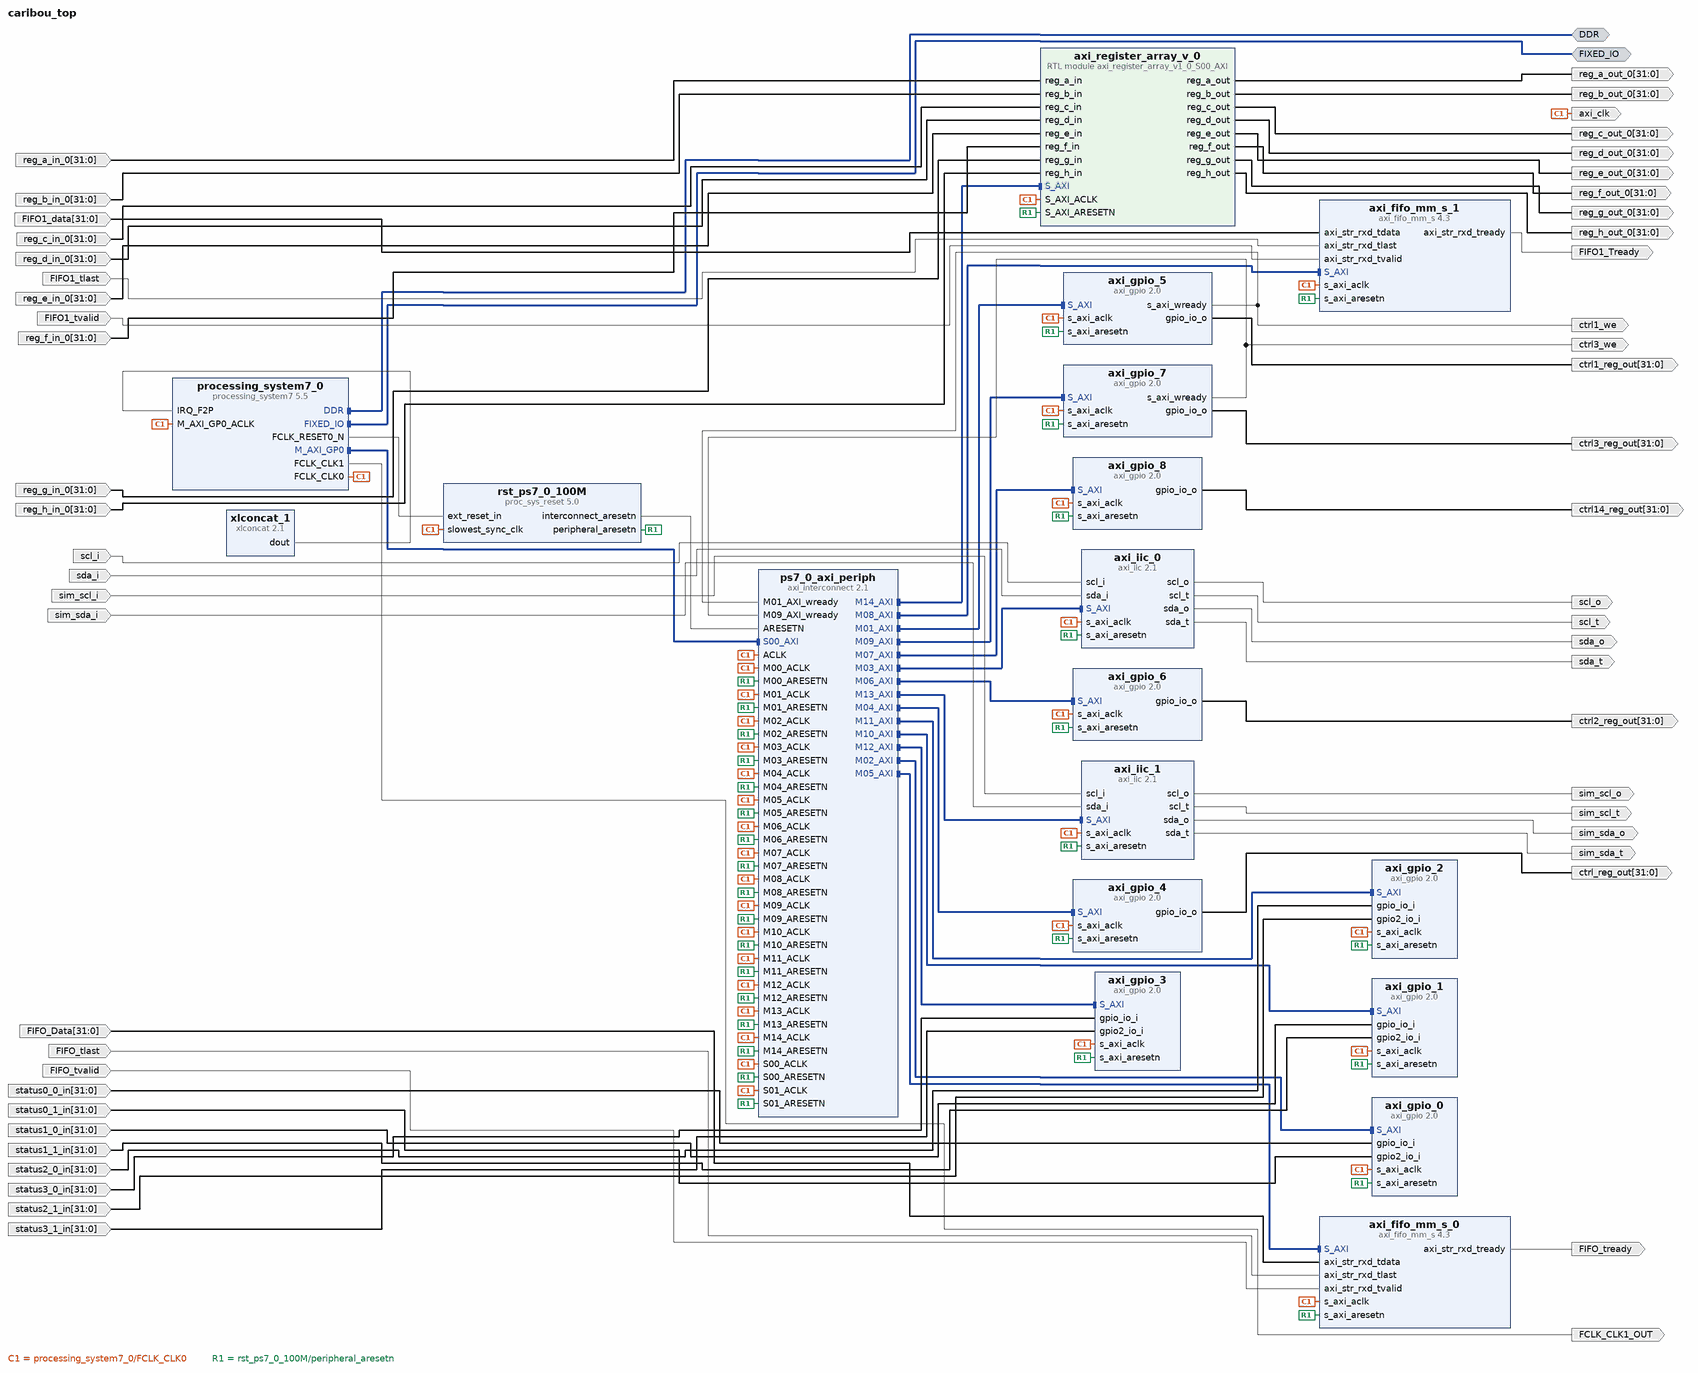
[diagram p0: block diagram of the top level]
# Vivado block design caribou_top, xc7z045ffg900-2, Vivado 2023.2
create_bd_design caribou_top

create_bd_intf_port -mode Master -vlnv xilinx.com:interface:ddrx_rtl:1.0 DDR
create_bd_intf_port -mode Master -vlnv xilinx.com:display_processing_system7:fixedio_rtl:1.0 FIXED_IO
create_bd_port -dir O axi_clk
create_bd_port -dir O -type clk scl_o
create_bd_port -dir I -type clk scl_i
create_bd_port -dir O sda_o
create_bd_port -dir O scl_t
create_bd_port -dir O sda_t
create_bd_port -dir I sda_i
create_bd_port -dir O -from 31 -to 0 -type data ctrl_reg_out
create_bd_port -dir I -from 31 -to 0 FIFO_Data
create_bd_port -dir I FIFO_tlast
create_bd_port -dir O FIFO_tready
create_bd_port -dir I FIFO_tvalid
create_bd_port -dir O -from 31 -to 0 -type data ctrl1_reg_out
create_bd_port -dir O -from 31 -to 0 -type data ctrl2_reg_out
create_bd_port -dir I -type data FIFO1_tlast
create_bd_port -dir I -from 31 -to 0 -type data FIFO1_data
create_bd_port -dir I -type data FIFO1_tvalid
create_bd_port -dir O -type data FIFO1_Tready
create_bd_port -dir I -from 31 -to 0 status0_0_in
create_bd_port -dir I -from 31 -to 0 status0_1_in
create_bd_port -dir O ctrl1_we
create_bd_port -dir O -from 31 -to 0 -type data ctrl3_reg_out
create_bd_port -dir O ctrl3_we
create_bd_port -dir O -from 31 -to 0 -type data ctrl14_reg_out
create_bd_port -dir I -from 31 -to 0 status1_0_in
create_bd_port -dir I -from 31 -to 0 status1_1_in
create_bd_port -dir O -type clk FCLK_CLK1_OUT
create_bd_port -dir I -from 31 -to 0 -type data status2_0_in
create_bd_port -dir I -from 31 -to 0 -type data status2_1_in
create_bd_port -dir I -from 31 -to 0 -type data status3_0_in
create_bd_port -dir I -from 31 -to 0 -type data status3_1_in
create_bd_port -dir O sim_scl_o
create_bd_port -dir O sim_scl_t
create_bd_port -dir O sim_sda_o
create_bd_port -dir O sim_sda_t
create_bd_port -dir I sim_scl_i
create_bd_port -dir I sim_sda_i
create_bd_port -dir I -from 31 -to 0 reg_a_in_0
create_bd_port -dir O -from 31 -to 0 reg_a_out_0
create_bd_port -dir I -from 31 -to 0 reg_b_in_0
create_bd_port -dir O -from 31 -to 0 reg_b_out_0
create_bd_port -dir I -from 31 -to 0 reg_c_in_0
create_bd_port -dir O -from 31 -to 0 reg_c_out_0
create_bd_port -dir I -from 31 -to 0 reg_d_in_0
create_bd_port -dir O -from 31 -to 0 reg_d_out_0
create_bd_port -dir I -from 31 -to 0 reg_e_in_0
create_bd_port -dir O -from 31 -to 0 reg_e_out_0
create_bd_port -dir I -from 31 -to 0 reg_f_in_0
create_bd_port -dir O -from 31 -to 0 reg_f_out_0
create_bd_port -dir I -from 31 -to 0 reg_g_in_0
create_bd_port -dir O -from 31 -to 0 reg_g_out_0
create_bd_port -dir I -from 31 -to 0 reg_h_in_0
create_bd_port -dir O -from 31 -to 0 reg_h_out_0

create_bd_cell -type ip -vlnv xilinx.com:ip:xlconcat:2.1 xlconcat_1
set_property -dict {CONFIG.NUM_PORTS 3 CONFIG.dout_width 3} [get_bd_cells xlconcat_1]
create_bd_cell -type ip -vlnv xilinx.com:ip:processing_system7:5.5 processing_system7_0
set_property -dict [list \
  CONFIG.PCW_APU_PERIPHERAL_FREQMHZ 800 \
  CONFIG.PCW_CPU_CPU_6X4X_MAX_RANGE 800 \
  CONFIG.PCW_DUAL_PARALLEL_QSPI_DATA_MODE x8 \
  CONFIG.PCW_ENET0_ENET0_IO {MIO 16 .. 27} \
  CONFIG.PCW_ENET0_GRP_MDIO_ENABLE 1 \
  CONFIG.PCW_ENET0_GRP_MDIO_IO {MIO 52 .. 53} \
  CONFIG.PCW_ENET0_PERIPHERAL_ENABLE 1 \
  CONFIG.PCW_ENET0_PERIPHERAL_FREQMHZ {100 Mbps} \
  CONFIG.PCW_ENET0_RESET_ENABLE 1 \
  CONFIG.PCW_ENET0_RESET_IO {MIO 47} \
  CONFIG.PCW_ENET_RESET_ENABLE 1 \
  CONFIG.PCW_ENET_RESET_SELECT {Share reset pin} \
  CONFIG.PCW_EN_CLK1_PORT 1 \
  CONFIG.PCW_FCLK_CLK1_BUF TRUE \
  CONFIG.PCW_FPGA0_PERIPHERAL_FREQMHZ 50 \
  CONFIG.PCW_FPGA1_PERIPHERAL_FREQMHZ 40 \
  CONFIG.PCW_FPGA_FCLK1_ENABLE 1 \
  CONFIG.PCW_GP0_EN_MODIFIABLE_TXN 0 \
  CONFIG.PCW_GP1_EN_MODIFIABLE_TXN 0 \
  CONFIG.PCW_GPIO_MIO_GPIO_ENABLE 1 \
  CONFIG.PCW_GPIO_MIO_GPIO_IO MIO \
  CONFIG.PCW_I2C0_GRP_INT_ENABLE 0 \
  CONFIG.PCW_I2C0_I2C0_IO {MIO 50 .. 51} \
  CONFIG.PCW_I2C0_PERIPHERAL_ENABLE 1 \
  CONFIG.PCW_I2C0_RESET_ENABLE 1 \
  CONFIG.PCW_I2C0_RESET_IO {MIO 46} \
  CONFIG.PCW_I2C_PERIPHERAL_FREQMHZ 133.333328 \
  CONFIG.PCW_I2C_RESET_ENABLE 1 \
  CONFIG.PCW_I2C_RESET_SELECT {Share reset pin} \
  CONFIG.PCW_IRQ_F2P_INTR 1 \
  CONFIG.PCW_M_AXI_GP0_FREQMHZ 200 \
  CONFIG.PCW_NUM_F2P_INTR_INPUTS 3 \
  CONFIG.PCW_PERIPHERAL_BOARD_PRESET part0 \
  CONFIG.PCW_PRESET_BANK0_VOLTAGE {LVCMOS 1.8V} \
  CONFIG.PCW_PRESET_BANK1_VOLTAGE {LVCMOS 1.8V} \
  CONFIG.PCW_QSPI_GRP_FBCLK_ENABLE 1 \
  CONFIG.PCW_QSPI_GRP_FBCLK_IO {MIO 8} \
  CONFIG.PCW_QSPI_GRP_IO1_ENABLE 1 \
  CONFIG.PCW_QSPI_GRP_IO1_IO {MIO 0 9 .. 13} \
  CONFIG.PCW_QSPI_GRP_SINGLE_SS_ENABLE 0 \
  CONFIG.PCW_QSPI_INTERNAL_HIGHADDRESS 0xFDFFFFFF \
  CONFIG.PCW_QSPI_PERIPHERAL_ENABLE 1 \
  CONFIG.PCW_QSPI_QSPI_IO {MIO 1 .. 6} \
  CONFIG.PCW_SD0_GRP_CD_ENABLE 1 \
  CONFIG.PCW_SD0_GRP_CD_IO {MIO 14} \
  CONFIG.PCW_SD0_GRP_WP_ENABLE 1 \
  CONFIG.PCW_SD0_GRP_WP_IO {MIO 15} \
  CONFIG.PCW_SD0_PERIPHERAL_ENABLE 1 \
  CONFIG.PCW_SD0_SD0_IO {MIO 40 .. 45} \
  CONFIG.PCW_SDIO_PERIPHERAL_FREQMHZ 50 \
  CONFIG.PCW_TTC0_PERIPHERAL_ENABLE 1 \
  CONFIG.PCW_TTC0_TTC0_IO EMIO \
  CONFIG.PCW_UART1_PERIPHERAL_ENABLE 1 \
  CONFIG.PCW_UART1_UART1_IO {MIO 48 .. 49} \
  CONFIG.PCW_UART_PERIPHERAL_FREQMHZ 50 \
  CONFIG.PCW_UIPARAM_DDR_FREQ_MHZ 533.333313 \
  CONFIG.PCW_UIPARAM_DDR_PARTNO Custom \
  CONFIG.PCW_UIPARAM_GENERATE_SUMMARY NONE \
  CONFIG.PCW_USB0_PERIPHERAL_ENABLE 1 \
  CONFIG.PCW_USB0_RESET_ENABLE 1 \
  CONFIG.PCW_USB0_RESET_IO {MIO 7} \
  CONFIG.PCW_USB0_USB0_IO {MIO 28 .. 39} \
  CONFIG.PCW_USB_RESET_ENABLE 1 \
  CONFIG.PCW_USB_RESET_SELECT {Share reset pin} \
  CONFIG.PCW_USE_FABRIC_INTERRUPT 1 \
  CONFIG.preset ZC706 \
] [get_bd_cells processing_system7_0]
# 517 more settings of processing_system7_0 are not shown: defaults, MIO pin electricals, DDR timing, and values the tool derives
create_bd_cell -type ip -vlnv xilinx.com:ip:axi_fifo_mm_s:4.3 axi_fifo_mm_s_0
set_property -dict [list \
  CONFIG.C_RX_FIFO_DEPTH 32768 \
  CONFIG.C_RX_FIFO_PE_THRESHOLD 5 \
  CONFIG.C_RX_FIFO_PF_THRESHOLD 32000 \
  CONFIG.C_USE_RX_DATA 1 \
  CONFIG.C_USE_TX_CTRL 0 \
  CONFIG.C_USE_TX_DATA 0 \
] [get_bd_cells axi_fifo_mm_s_0]
create_bd_cell -type ip -vlnv xilinx.com:ip:axi_fifo_mm_s:4.3 axi_fifo_mm_s_1
set_property -dict [list \
  CONFIG.C_HAS_AXIS_TSTRB false \
  CONFIG.C_RX_FIFO_DEPTH 32768 \
  CONFIG.C_RX_FIFO_PE_THRESHOLD 5 \
  CONFIG.C_RX_FIFO_PF_THRESHOLD 32000 \
  CONFIG.C_USE_TX_CTRL 0 \
  CONFIG.C_USE_TX_DATA 0 \
] [get_bd_cells axi_fifo_mm_s_1]
create_bd_cell -type ip -vlnv xilinx.com:ip:axi_iic:2.1 axi_iic_0
set_property -dict {CONFIG.IIC_FREQ_KHZ 400} [get_bd_cells axi_iic_0]
create_bd_cell -type ip -vlnv xilinx.com:ip:axi_interconnect:2.1 ps7_0_axi_periph
set_property -dict {CONFIG.NUM_MI 15 CONFIG.NUM_SI 2 CONFIG.SYNCHRONIZATION_STAGES 2} [get_bd_cells ps7_0_axi_periph]
create_bd_cell -type ip -vlnv xilinx.com:ip:proc_sys_reset:5.0 rst_ps7_0_100M
create_bd_cell -type ip -vlnv xilinx.com:ip:axi_gpio:2.0 axi_gpio_0
set_property -dict [list \
  CONFIG.C_ALL_INPUTS 1 \
  CONFIG.C_ALL_INPUTS_2 1 \
  CONFIG.C_GPIO_WIDTH 32 \
  CONFIG.C_IS_DUAL 1 \
  CONFIG.GPIO2_BOARD_INTERFACE Custom \
  CONFIG.GPIO_BOARD_INTERFACE Custom \
  CONFIG.USE_BOARD_FLOW true \
] [get_bd_cells axi_gpio_0]
create_bd_cell -type ip -vlnv xilinx.com:ip:axi_gpio:2.0 axi_gpio_1
set_property -dict [list \
  CONFIG.C_ALL_INPUTS 1 \
  CONFIG.C_ALL_INPUTS_2 1 \
  CONFIG.C_GPIO_WIDTH 32 \
  CONFIG.C_IS_DUAL 1 \
  CONFIG.GPIO2_BOARD_INTERFACE Custom \
  CONFIG.GPIO_BOARD_INTERFACE Custom \
  CONFIG.USE_BOARD_FLOW true \
] [get_bd_cells axi_gpio_1]
create_bd_cell -type ip -vlnv xilinx.com:ip:axi_gpio:2.0 axi_gpio_2
set_property -dict [list \
  CONFIG.C_ALL_INPUTS 1 \
  CONFIG.C_ALL_INPUTS_2 1 \
  CONFIG.C_GPIO_WIDTH 32 \
  CONFIG.C_IS_DUAL 1 \
  CONFIG.GPIO_BOARD_INTERFACE Custom \
  CONFIG.USE_BOARD_FLOW true \
] [get_bd_cells axi_gpio_2]
create_bd_cell -type ip -vlnv xilinx.com:ip:axi_gpio:2.0 axi_gpio_3
set_property -dict {CONFIG.C_ALL_INPUTS 1 CONFIG.C_ALL_INPUTS_2 1 CONFIG.C_IS_DUAL 1} [get_bd_cells axi_gpio_3]
create_bd_cell -type ip -vlnv xilinx.com:ip:axi_iic:2.1 axi_iic_1
set_property -dict {CONFIG.IIC_FREQ_KHZ 400} [get_bd_cells axi_iic_1]
create_bd_cell -type module -reference axi_register_array_v1_0_S00_AXI axi_register_array_v_0
create_bd_cell -type ip -vlnv xilinx.com:ip:axi_gpio:2.0 axi_gpio_4
set_property -dict {CONFIG.C_ALL_OUTPUTS 1} [get_bd_cells axi_gpio_4]
create_bd_cell -type ip -vlnv xilinx.com:ip:axi_gpio:2.0 axi_gpio_5
set_property -dict {CONFIG.C_ALL_OUTPUTS 1} [get_bd_cells axi_gpio_5]
create_bd_cell -type ip -vlnv xilinx.com:ip:axi_gpio:2.0 axi_gpio_6
set_property -dict {CONFIG.C_ALL_OUTPUTS 1} [get_bd_cells axi_gpio_6]
create_bd_cell -type ip -vlnv xilinx.com:ip:axi_gpio:2.0 axi_gpio_7
set_property -dict {CONFIG.C_ALL_OUTPUTS 1} [get_bd_cells axi_gpio_7]
create_bd_cell -type ip -vlnv xilinx.com:ip:axi_gpio:2.0 axi_gpio_8
set_property -dict {CONFIG.C_ALL_OUTPUTS 1} [get_bd_cells axi_gpio_8]

# ---- connections ----

connect_bd_intf_net [get_bd_intf_ports DDR] [get_bd_intf_pins processing_system7_0/DDR]
connect_bd_intf_net [get_bd_intf_ports FIXED_IO] [get_bd_intf_pins processing_system7_0/FIXED_IO]
connect_bd_intf_net [get_bd_intf_pins processing_system7_0/M_AXI_GP0] [get_bd_intf_pins ps7_0_axi_periph/S00_AXI]
connect_bd_intf_net [get_bd_intf_pins ps7_0_axi_periph/M01_AXI] [get_bd_intf_pins axi_gpio_5/S_AXI]
connect_bd_intf_net [get_bd_intf_pins ps7_0_axi_periph/M02_AXI] [get_bd_intf_pins axi_gpio_0/S_AXI]
connect_bd_intf_net [get_bd_intf_pins ps7_0_axi_periph/M03_AXI] [get_bd_intf_pins axi_iic_0/S_AXI]
connect_bd_intf_net [get_bd_intf_pins ps7_0_axi_periph/M04_AXI] [get_bd_intf_pins axi_gpio_4/S_AXI]
connect_bd_intf_net [get_bd_intf_pins ps7_0_axi_periph/M05_AXI] [get_bd_intf_pins axi_fifo_mm_s_0/S_AXI]
connect_bd_intf_net [get_bd_intf_pins ps7_0_axi_periph/M06_AXI] [get_bd_intf_pins axi_gpio_6/S_AXI]
connect_bd_intf_net [get_bd_intf_pins ps7_0_axi_periph/M07_AXI] [get_bd_intf_pins axi_gpio_8/S_AXI]
connect_bd_intf_net [get_bd_intf_pins ps7_0_axi_periph/M08_AXI] [get_bd_intf_pins axi_fifo_mm_s_1/S_AXI]
connect_bd_intf_net [get_bd_intf_pins ps7_0_axi_periph/M09_AXI] [get_bd_intf_pins axi_gpio_7/S_AXI]
connect_bd_intf_net [get_bd_intf_pins ps7_0_axi_periph/M10_AXI] [get_bd_intf_pins axi_gpio_1/S_AXI]
connect_bd_intf_net [get_bd_intf_pins ps7_0_axi_periph/M11_AXI] [get_bd_intf_pins axi_gpio_2/S_AXI]
connect_bd_intf_net [get_bd_intf_pins ps7_0_axi_periph/M12_AXI] [get_bd_intf_pins axi_gpio_3/S_AXI]
connect_bd_intf_net [get_bd_intf_pins ps7_0_axi_periph/M13_AXI] [get_bd_intf_pins axi_iic_1/S_AXI]
connect_bd_intf_net [get_bd_intf_pins ps7_0_axi_periph/M14_AXI] [get_bd_intf_pins axi_register_array_v_0/S_AXI]
connect_bd_net [get_bd_ports FIFO1_data] [get_bd_pins axi_fifo_mm_s_1/axi_str_rxd_tdata]
connect_bd_net [get_bd_ports FIFO1_tlast] [get_bd_pins axi_fifo_mm_s_1/axi_str_rxd_tlast]
connect_bd_net [get_bd_ports FIFO1_tvalid] [get_bd_pins axi_fifo_mm_s_1/axi_str_rxd_tvalid]
connect_bd_net [get_bd_ports FIFO_Data] [get_bd_pins axi_fifo_mm_s_0/axi_str_rxd_tdata]
connect_bd_net [get_bd_ports FIFO_tlast] [get_bd_pins axi_fifo_mm_s_0/axi_str_rxd_tlast]
connect_bd_net [get_bd_ports FIFO_tvalid] [get_bd_pins axi_fifo_mm_s_0/axi_str_rxd_tvalid]
connect_bd_net [get_bd_pins axi_fifo_mm_s_0/axi_str_rxd_tready] [get_bd_ports FIFO_tready]
connect_bd_net [get_bd_pins axi_fifo_mm_s_1/axi_str_rxd_tready] [get_bd_ports FIFO1_Tready]
connect_bd_net [get_bd_pins axi_gpio_4/gpio_io_o] [get_bd_ports ctrl_reg_out]
connect_bd_net [get_bd_pins axi_gpio_5/gpio_io_o] [get_bd_ports ctrl1_reg_out]
connect_bd_net [get_bd_pins axi_gpio_6/gpio_io_o] [get_bd_ports ctrl2_reg_out]
connect_bd_net [get_bd_pins axi_gpio_7/gpio_io_o] [get_bd_ports ctrl3_reg_out]
connect_bd_net [get_bd_pins axi_gpio_8/gpio_io_o] [get_bd_ports ctrl14_reg_out]
connect_bd_net [get_bd_pins axi_iic_0/scl_o] [get_bd_ports scl_o]
connect_bd_net [get_bd_pins axi_iic_0/scl_t] [get_bd_ports scl_t]
connect_bd_net [get_bd_pins axi_iic_0/sda_o] [get_bd_ports sda_o]
connect_bd_net [get_bd_pins axi_iic_0/sda_t] [get_bd_ports sda_t]
connect_bd_net [get_bd_pins axi_iic_1/scl_o] [get_bd_ports sim_scl_o]
connect_bd_net [get_bd_pins axi_iic_1/scl_t] [get_bd_ports sim_scl_t]
connect_bd_net [get_bd_pins axi_iic_1/sda_o] [get_bd_ports sim_sda_o]
connect_bd_net [get_bd_pins axi_iic_1/sda_t] [get_bd_ports sim_sda_t]
connect_bd_net [get_bd_pins axi_register_array_v_0/reg_a_out] [get_bd_ports reg_a_out_0]
connect_bd_net [get_bd_pins axi_register_array_v_0/reg_b_out] [get_bd_ports reg_b_out_0]
connect_bd_net [get_bd_pins axi_register_array_v_0/reg_c_out] [get_bd_ports reg_c_out_0]
connect_bd_net [get_bd_pins axi_register_array_v_0/reg_d_out] [get_bd_ports reg_d_out_0]
connect_bd_net [get_bd_pins axi_register_array_v_0/reg_e_out] [get_bd_ports reg_e_out_0]
connect_bd_net [get_bd_pins axi_register_array_v_0/reg_f_out] [get_bd_ports reg_f_out_0]
connect_bd_net [get_bd_pins axi_register_array_v_0/reg_g_out] [get_bd_ports reg_g_out_0]
connect_bd_net [get_bd_pins axi_register_array_v_0/reg_h_out] [get_bd_ports reg_h_out_0]
connect_bd_net -net control_register_1_s00_axi_wready [get_bd_pins axi_gpio_5/s_axi_wready] \
  [get_bd_ports ctrl1_we] [get_bd_pins ps7_0_axi_periph/M01_AXI_wready]
connect_bd_net -net control_register_3_s00_axi_wready [get_bd_pins axi_gpio_7/s_axi_wready] \
  [get_bd_ports ctrl3_we] [get_bd_pins ps7_0_axi_periph/M09_AXI_wready]
connect_bd_net [get_bd_pins processing_system7_0/FCLK_CLK0] \
  [get_bd_ports axi_clk] [get_bd_pins axi_register_array_v_0/S_AXI_ACLK] [get_bd_pins axi_fifo_mm_s_0/s_axi_aclk] \
  [get_bd_pins axi_fifo_mm_s_1/s_axi_aclk] [get_bd_pins axi_gpio_0/s_axi_aclk] [get_bd_pins axi_gpio_1/s_axi_aclk] \
  [get_bd_pins axi_gpio_2/s_axi_aclk] [get_bd_pins axi_gpio_3/s_axi_aclk] [get_bd_pins axi_iic_0/s_axi_aclk] \
  [get_bd_pins axi_iic_1/s_axi_aclk] [get_bd_pins processing_system7_0/M_AXI_GP0_ACLK] [get_bd_pins ps7_0_axi_periph/ACLK] \
  [get_bd_pins ps7_0_axi_periph/S00_ACLK] [get_bd_pins ps7_0_axi_periph/S01_ACLK] [get_bd_pins ps7_0_axi_periph/M00_ACLK] \
  [get_bd_pins ps7_0_axi_periph/M01_ACLK] [get_bd_pins ps7_0_axi_periph/M02_ACLK] [get_bd_pins ps7_0_axi_periph/M03_ACLK] \
  [get_bd_pins ps7_0_axi_periph/M04_ACLK] [get_bd_pins ps7_0_axi_periph/M05_ACLK] [get_bd_pins ps7_0_axi_periph/M06_ACLK] \
  [get_bd_pins ps7_0_axi_periph/M07_ACLK] [get_bd_pins ps7_0_axi_periph/M08_ACLK] [get_bd_pins ps7_0_axi_periph/M09_ACLK] \
  [get_bd_pins ps7_0_axi_periph/M10_ACLK] [get_bd_pins ps7_0_axi_periph/M11_ACLK] [get_bd_pins ps7_0_axi_periph/M12_ACLK] \
  [get_bd_pins ps7_0_axi_periph/M13_ACLK] [get_bd_pins ps7_0_axi_periph/M14_ACLK] \
  [get_bd_pins rst_ps7_0_100M/slowest_sync_clk] [get_bd_pins axi_gpio_4/s_axi_aclk] [get_bd_pins axi_gpio_5/s_axi_aclk] \
  [get_bd_pins axi_gpio_6/s_axi_aclk] [get_bd_pins axi_gpio_7/s_axi_aclk] [get_bd_pins axi_gpio_8/s_axi_aclk]
connect_bd_net [get_bd_pins processing_system7_0/FCLK_CLK1] [get_bd_ports FCLK_CLK1_OUT]
connect_bd_net [get_bd_pins processing_system7_0/FCLK_RESET0_N] [get_bd_pins rst_ps7_0_100M/ext_reset_in]
connect_bd_net -net reg_a_in_0_1 [get_bd_ports reg_a_in_0] [get_bd_pins axi_register_array_v_0/reg_a_in]
connect_bd_net -net reg_b_in_0_1 [get_bd_ports reg_b_in_0] [get_bd_pins axi_register_array_v_0/reg_b_in]
connect_bd_net -net reg_c_in_0_1 [get_bd_ports reg_c_in_0] [get_bd_pins axi_register_array_v_0/reg_c_in]
connect_bd_net -net reg_d_in_0_1 [get_bd_ports reg_d_in_0] [get_bd_pins axi_register_array_v_0/reg_d_in]
connect_bd_net -net reg_e_in_0_1 [get_bd_ports reg_e_in_0] [get_bd_pins axi_register_array_v_0/reg_e_in]
connect_bd_net -net reg_f_in_0_1 [get_bd_ports reg_f_in_0] [get_bd_pins axi_register_array_v_0/reg_f_in]
connect_bd_net -net reg_g_in_0_1 [get_bd_ports reg_g_in_0] [get_bd_pins axi_register_array_v_0/reg_g_in]
connect_bd_net -net reg_h_in_0_1 [get_bd_ports reg_h_in_0] [get_bd_pins axi_register_array_v_0/reg_h_in]
connect_bd_net [get_bd_pins rst_ps7_0_100M/interconnect_aresetn] [get_bd_pins ps7_0_axi_periph/ARESETN]
connect_bd_net [get_bd_pins rst_ps7_0_100M/peripheral_aresetn] \
  [get_bd_pins axi_register_array_v_0/S_AXI_ARESETN] [get_bd_pins axi_fifo_mm_s_0/s_axi_aresetn] \
  [get_bd_pins axi_fifo_mm_s_1/s_axi_aresetn] [get_bd_pins axi_gpio_0/s_axi_aresetn] [get_bd_pins axi_gpio_1/s_axi_aresetn] \
  [get_bd_pins axi_gpio_2/s_axi_aresetn] [get_bd_pins axi_gpio_3/s_axi_aresetn] [get_bd_pins axi_iic_0/s_axi_aresetn] \
  [get_bd_pins axi_iic_1/s_axi_aresetn] [get_bd_pins ps7_0_axi_periph/S00_ARESETN] [get_bd_pins ps7_0_axi_periph/S01_ARESETN] \
  [get_bd_pins ps7_0_axi_periph/M00_ARESETN] [get_bd_pins ps7_0_axi_periph/M01_ARESETN] \
  [get_bd_pins ps7_0_axi_periph/M02_ARESETN] [get_bd_pins ps7_0_axi_periph/M03_ARESETN] \
  [get_bd_pins ps7_0_axi_periph/M04_ARESETN] [get_bd_pins ps7_0_axi_periph/M05_ARESETN] \
  [get_bd_pins ps7_0_axi_periph/M06_ARESETN] [get_bd_pins ps7_0_axi_periph/M07_ARESETN] \
  [get_bd_pins ps7_0_axi_periph/M08_ARESETN] [get_bd_pins ps7_0_axi_periph/M09_ARESETN] \
  [get_bd_pins ps7_0_axi_periph/M10_ARESETN] [get_bd_pins ps7_0_axi_periph/M11_ARESETN] \
  [get_bd_pins ps7_0_axi_periph/M12_ARESETN] [get_bd_pins ps7_0_axi_periph/M13_ARESETN] \
  [get_bd_pins ps7_0_axi_periph/M14_ARESETN] [get_bd_pins axi_gpio_4/s_axi_aresetn] [get_bd_pins axi_gpio_5/s_axi_aresetn] \
  [get_bd_pins axi_gpio_6/s_axi_aresetn] [get_bd_pins axi_gpio_7/s_axi_aresetn] [get_bd_pins axi_gpio_8/s_axi_aresetn]
connect_bd_net [get_bd_ports scl_i] [get_bd_pins axi_iic_0/scl_i]
connect_bd_net [get_bd_ports sda_i] [get_bd_pins axi_iic_0/sda_i]
connect_bd_net [get_bd_ports sim_scl_i] [get_bd_pins axi_iic_1/scl_i]
connect_bd_net [get_bd_ports sim_sda_i] [get_bd_pins axi_iic_1/sda_i]
connect_bd_net [get_bd_ports status0_0_in] [get_bd_pins axi_gpio_0/gpio_io_i]
connect_bd_net [get_bd_ports status0_1_in] [get_bd_pins axi_gpio_0/gpio2_io_i]
connect_bd_net [get_bd_ports status1_0_in] [get_bd_pins axi_gpio_1/gpio_io_i]
connect_bd_net [get_bd_ports status1_1_in] [get_bd_pins axi_gpio_1/gpio2_io_i]
connect_bd_net [get_bd_ports status2_0_in] [get_bd_pins axi_gpio_2/gpio_io_i]
connect_bd_net [get_bd_ports status2_1_in] [get_bd_pins axi_gpio_2/gpio2_io_i]
connect_bd_net [get_bd_ports status3_0_in] [get_bd_pins axi_gpio_3/gpio_io_i]
connect_bd_net [get_bd_ports status3_1_in] [get_bd_pins axi_gpio_3/gpio2_io_i]
connect_bd_net [get_bd_pins xlconcat_1/dout] [get_bd_pins processing_system7_0/IRQ_F2P]

# ---- address map ----
assign_bd_address -offset 0x41200000 -range 4K -target_address_space [get_bd_addr_spaces processing_system7_0/Data] [get_bd_addr_segs axi_gpio_1/S_AXI/Reg]
assign_bd_address -offset 0x41210000 -range 64K -target_address_space [get_bd_addr_spaces processing_system7_0/Data] [get_bd_addr_segs axi_gpio_2/S_AXI/Reg]
assign_bd_address -offset 0x41220000 -range 64K -target_address_space [get_bd_addr_spaces processing_system7_0/Data] [get_bd_addr_segs axi_gpio_3/S_AXI/Reg]
assign_bd_address -offset 0x41600000 -range 64K -target_address_space [get_bd_addr_spaces processing_system7_0/Data] [get_bd_addr_segs axi_iic_0/S_AXI/Reg]
assign_bd_address -offset 0x41610000 -range 64K -target_address_space [get_bd_addr_spaces processing_system7_0/Data] [get_bd_addr_segs axi_iic_1/S_AXI/Reg]
assign_bd_address -offset 0x43C10000 -range 4K -target_address_space [get_bd_addr_spaces processing_system7_0/Data] [get_bd_addr_segs axi_gpio_5/S_AXI/Reg]
assign_bd_address -offset 0x43C20000 -range 4K -target_address_space [get_bd_addr_spaces processing_system7_0/Data] [get_bd_addr_segs axi_gpio_6/S_AXI/Reg]
assign_bd_address -offset 0x43C30000 -range 64K -target_address_space [get_bd_addr_spaces processing_system7_0/Data] [get_bd_addr_segs axi_gpio_0/S_AXI/Reg]
assign_bd_address -offset 0x43C40000 -range 64K -target_address_space [get_bd_addr_spaces processing_system7_0/Data] [get_bd_addr_segs axi_fifo_mm_s_1/S_AXI/Mem0]
assign_bd_address -offset 0x43C50000 -range 64K -target_address_space [get_bd_addr_spaces processing_system7_0/Data] [get_bd_addr_segs axi_gpio_4/S_AXI/Reg]
assign_bd_address -offset 0x43C60000 -range 64K -target_address_space [get_bd_addr_spaces processing_system7_0/Data] [get_bd_addr_segs axi_fifo_mm_s_0/S_AXI/Mem0]
assign_bd_address -offset 0x43C70000 -range 64K -target_address_space [get_bd_addr_spaces processing_system7_0/Data] [get_bd_addr_segs axi_gpio_7/S_AXI/Reg]
assign_bd_address -offset 0x43C80000 -range 4K -target_address_space [get_bd_addr_spaces processing_system7_0/Data] [get_bd_addr_segs axi_gpio_8/S_AXI/Reg]
assign_bd_address -offset 0x43C90000 -range 64K -target_address_space [get_bd_addr_spaces processing_system7_0/Data] [get_bd_addr_segs axi_register_array_v_0/S_AXI/reg0]

set_property USER_COMMENTS.comment_0 FIFOs [current_bd_design]
set_property USER_COMMENTS.comment_1 CTRL_REG [current_bd_design]
set_property USER_COMMENTS.comment_2 I2C [current_bd_design]
set_property USER_COMMENTS.comment_3 STAT_REG [current_bd_design]

validate_bd_design
save_bd_design
